# Altium schematic sheet Bandpass.SchDoc
size A; SheetNumber: 2; SheetTotal: 4
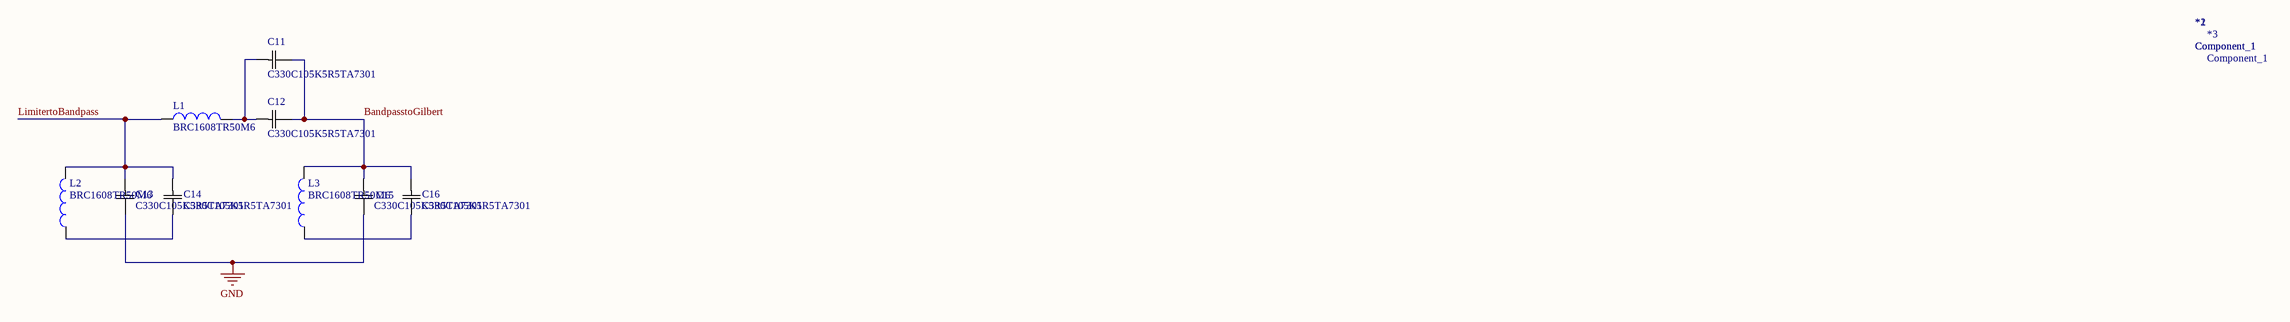
[diagram p0: Bandpass.SchDoc]

## Parts
*1  Component_1
*2  Component_1
*3  Component_1
C11  C330C105K5R5TA7301  [CAP_C330C_MR_X7R_KEM]
C12  C330C105K5R5TA7301  [CAP_C330C_MR_X7R_KEM]
C13  C330C105K5R5TA7301  [CAP_C330C_MR_X7R_KEM]
C14  C330C105K5R5TA7301  [CAP_C330C_MR_X7R_KEM]
C15  C330C105K5R5TA7301  [CAP_C330C_MR_X7R_KEM]
C16  C330C105K5R5TA7301  [CAP_C330C_MR_X7R_KEM]
L1  BRC1608TR50M6  [INDC1608X100N]
L2  BRC1608TR50M6  [INDC1608X100N]
L3  BRC1608TR50M6  [INDC1608X100N]

## Nets
GND: C13.2 C15.2
BandpasstoGilbert: C11.2 C12.2 C15.1 C16.1 L3.2
LimitertoBandpass: C13.1 C14.1 L1.1 L2.2
NetC11_1: C11.1 C12.1 L1.2
NetC14_2: C14.2 L2.1
NetC16_2: C16.2 L3.1

## Library data of the parts
C11-C16 = C330C105K5R5TA7301: No Description Available; Mfr_Name: Kemet
L1-L3 = BRC1608TR50M6: Inductor Power Chip Wirewound 500nH 20% 6MHz Ferrite 1.05A 117mOhm DCR 0603 T/R; Package: None; Price: None; Value: *; MP: BRC1608TR50M6; Availability: Unavailable